# Altium schematic sheet LEDBoard.SchDoc
size A
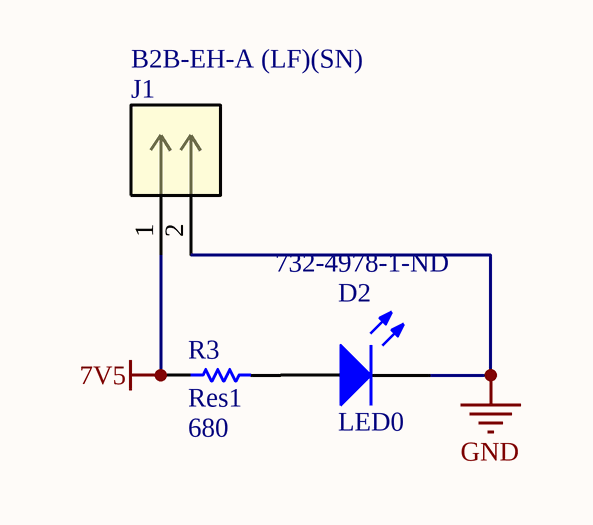
[diagram p0: LEDBoard.SchDoc]

## Parts
D2  LED0  Supplier Part Number 1: 732-4978-1-ND  [1608[0603]]
J1  B2B-EH-A (LF)(SN)  [CONN_B2B-EH-A (LF)(SN)_JST]
R3  Res1  value 680  [6-0805_N]

## Nets
7V5: J1.1 R3.1
GND: D2.2(K) J1.2
NetD2_1: D2.1(A) R3.2

## Library data of the parts
D2 = LED0: Typical INFRARED GaAs LED; Published: 8-Jun-2000; LatestRevisionDate: 08-Jul-2005; LatestRevisionNote: Mech Layer 1 removed.; PackageReference: LED-0; Publisher: Altium Limited; PackageDescription: LED; 2 Leads; Supplier 1: Digi-Key
J1 = B2B-EH-A (LF)(SN): No Description Available; Vendor: JST; Built_By: EMA_TJ; SourceLibrary: JST_2019-01-31; Copyright: Copyright (C) 2018 Accelerated Designs. All rights reserved; Manufacturer_Part_Number: B2B-EH-A (LF)(SN); RefDes: RefDes; Type: DEV
R3 = Res1: Resistor; Published: 8-Jun-2000; LatestRevisionDate: 17-Jul-2002; LatestRevisionNote: Re-released for DXP Platform.; PackageReference: AXIAL-0.3; Publisher: Altium Limited; PackageDescription: Axial Device, Thru-Hole; 2 Leads; 0.3 in Pin Spacing